# Altium schematic sheet Top.SchDoc
size A4
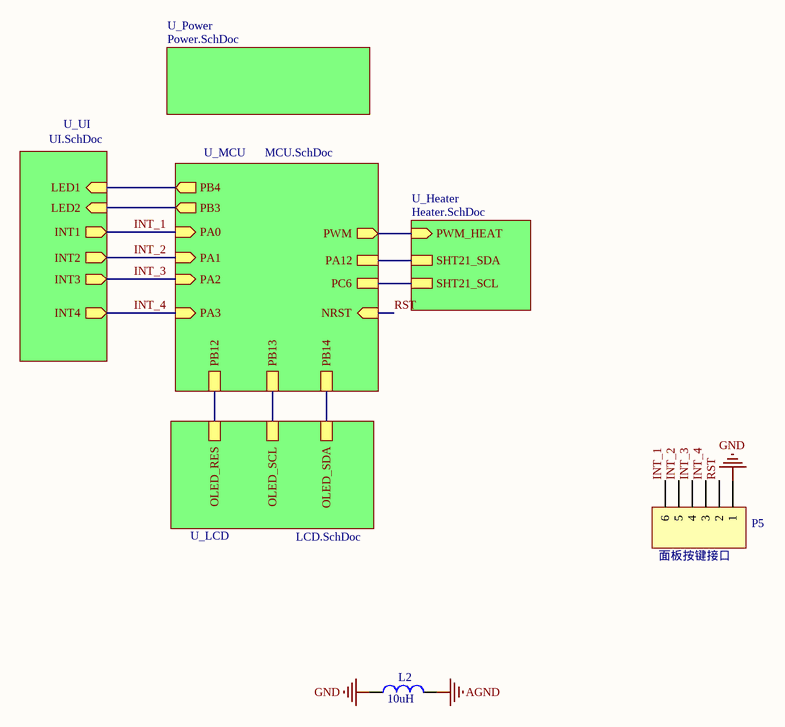
[diagram p0: Top.SchDoc]

## Parts
L2  value 10uH  [0805]  (hidden comment: Inductor)
P5  面板按键接口  [软排线插座6P-0.5mm]

## Sub-sheets
U_Heater = Heater.SchDoc: SHT21_SCL, SHT21_SDA, PWM_HEAT (in)
U_LCD = LCD.SchDoc: OLED_SDA, OLED_SCL, OLED_RES
U_MCU = MCU.SchDoc: PWM (out), NRST (in), PA0 (in), PA1 (in), PA2 (in), PA3 (in), PB12, PB13, PB14, PB3 (out), PB4 (out), PC6, PA12
U_Power = Power.SchDoc: no entries
U_UI = UI.SchDoc: INT1 (out), INT2 (out), INT3 (out), INT4 (out), LED1 (in), LED2 (in)

## Nets
AGND: L2.2
GND: L2.1 P5.1
INT_1: P5.6 ; sheet U_MCU/PA0, sheet U_UI/INT1
INT_2: P5.5 ; sheet U_MCU/PA1, sheet U_UI/INT2
INT_3: P5.4 ; sheet U_MCU/PA2, sheet U_UI/INT3
INT_4: P5.3 ; sheet U_MCU/PA3, sheet U_UI/INT4
RST: P5.2 ; sheet U_MCU/NRST
(unnamed): sheet U_MCU/PWM, sheet U_Heater/PWM_HEAT
(unnamed): sheet U_MCU/PB12, sheet U_LCD/OLED_RES
(unnamed): sheet U_MCU/PB13, sheet U_LCD/OLED_SCL
(unnamed): sheet U_MCU/PB14, sheet U_LCD/OLED_SDA
(unnamed): sheet U_MCU/PB3, sheet U_UI/LED2
(unnamed): sheet U_MCU/PB4, sheet U_UI/LED1
(unnamed): sheet U_MCU/PC6, sheet U_Heater/SHT21_SCL
(unnamed): sheet U_MCU/PA12, sheet U_Heater/SHT21_SDA

## Library data of the parts
P5 = Header 6: Header, 6-Pin; LatestRevisionDate: 17-Jul-2002; LatestRevisionNote: Re-released for DXP Platform.; Publisher: Altium Limited